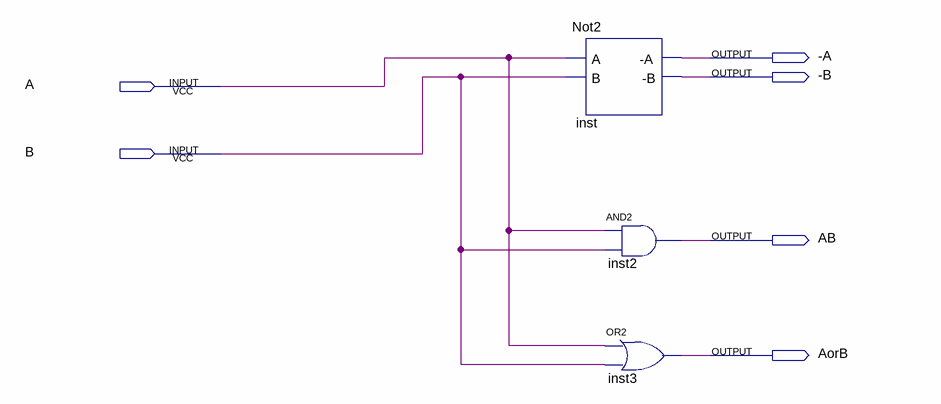
[diagram p0: schematic sheet]
// Quartus schematic compuertas.bdf as structural Verilog: 3 symbols, 6 pins
module compuertas (
  input  A,
  input  B,
  output \-A ,
  output \-B ,
  output AB,
  output AorB
);

  Not2 inst (.A(A), .B(B), .\-A (\-A ), .\-B (\-B ));
  and inst2 (AB, A, B);
  or inst3 (AorB, A, B);
endmodule
